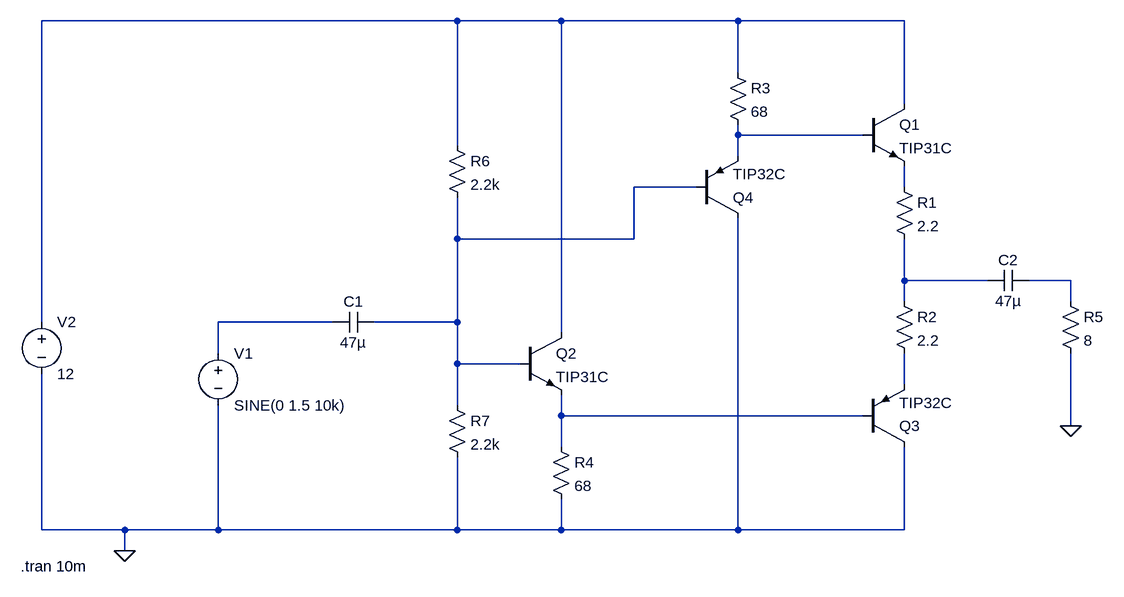
[diagram p0: schematic class AB operation with emitter follower.asc]
class AB operation with emitter follower.asc, the LTspice schematic file:
Version 4
SHEET 1 988 680
WIRE -16 -192 -656 -192
WIRE 144 -192 -16 -192
WIRE 416 -192 144 -192
WIRE 672 -192 416 -192
WIRE 416 -112 416 -192
WIRE 672 -64 672 -192
WIRE 416 -16 416 -32
WIRE 608 -16 416 -16
WIRE -16 0 -16 -192
WIRE 416 16 416 -16
WIRE 352 64 256 64
WIRE 672 64 672 32
WIRE -16 144 -16 80
WIRE 256 144 256 64
WIRE 256 144 -16 144
WIRE 672 208 672 144
WIRE 800 208 672 208
WIRE 928 208 864 208
WIRE 672 240 672 208
WIRE 928 240 928 208
WIRE -656 272 -656 -192
WIRE -208 272 -384 272
WIRE -16 272 -16 144
WIRE -16 272 -144 272
WIRE 144 288 144 -192
WIRE -384 320 -384 272
WIRE -16 336 -16 272
WIRE 80 336 -16 336
WIRE 672 368 672 320
WIRE -16 400 -16 336
WIRE 144 416 144 384
WIRE 608 416 144 416
WIRE 928 432 928 320
WIRE 144 464 144 416
WIRE -656 592 -656 352
WIRE -528 592 -656 592
WIRE -384 592 -384 400
WIRE -384 592 -528 592
WIRE -16 592 -16 480
WIRE -16 592 -384 592
WIRE 144 592 144 544
WIRE 144 592 -16 592
WIRE 416 592 416 112
WIRE 416 592 144 592
WIRE 672 592 672 464
WIRE 672 592 416 592
WIRE -528 624 -528 592
FLAG -528 624 0
FLAG 928 432 0
SYMBOL npn 608 -64 R0
SYMATTR InstName Q1
SYMATTR Value TIP31C
SYMBOL npn 80 288 R0
SYMATTR InstName Q2
SYMATTR Value TIP31C
SYMBOL pnp 608 464 M180
SYMATTR InstName Q3
SYMATTR Value TIP32C
SYMBOL pnp 352 112 M180
SYMATTR InstName Q4
SYMATTR Value TIP32C
SYMBOL res 656 48 R0
SYMATTR InstName R1
SYMATTR Value 2.2
SYMBOL res 656 224 R0
SYMATTR InstName R2
SYMATTR Value 2.2
SYMBOL res 400 -128 R0
SYMATTR InstName R3
SYMATTR Value 68
SYMBOL res 128 448 R0
SYMATTR InstName R4
SYMATTR Value 68
SYMBOL res 912 224 R0
SYMATTR InstName R5
SYMATTR Value 8
SYMBOL voltage -384 304 R0
WINDOW 123 0 0 Left 0
WINDOW 39 0 0 Left 0
SYMATTR InstName V1
SYMATTR Value SINE(0 1.5 10k)
SYMBOL voltage -656 256 R0
WINDOW 123 0 0 Left 0
WINDOW 39 0 0 Left 0
SYMATTR InstName V2
SYMATTR Value 12
SYMBOL res -32 -16 R0
SYMATTR InstName R6
SYMATTR Value 2.2k
SYMBOL res -32 384 R0
SYMATTR InstName R7
SYMATTR Value 2.2k
SYMBOL cap -144 256 R90
WINDOW 0 0 32 VBottom 2
WINDOW 3 32 32 VTop 2
SYMATTR InstName C1
SYMATTR Value 47µ
SYMBOL cap 864 192 R90
WINDOW 0 0 32 VBottom 2
WINDOW 3 32 32 VTop 2
SYMATTR InstName C2
SYMATTR Value 47µ
TEXT -688 648 Left 2 !.tran 10m

The netlist it stands for:
* class AB operation with emitter follower.asc
Q1 N001 N002 N004 0 TIP31C
Q2 N001 N003 N009 0 TIP31C
Q3 0 N009 N008 0 TIP32C
Q4 0 N003 N002 0 TIP32C
R1 N004 N005 2.2
R2 N005 N008 2.2
R3 N001 N002 68
R4 N009 0 68
R5 N006 0 8
V1 N007 0 SINE(0 1.5 10k)
V2 N001 0 12
R6 N001 N003 2.2k
R7 N003 0 2.2k
C1 N003 N007 47µ
C2 N006 N005 47µ
.model NPN NPN
.model PNP PNP
.lib standard.bjt
.tran 10m
.backanno
.end